# Altium schematic sheet LV_hairDrier.SchDoc
size OrCAD B; SheetNumber: 1; SheetTotal: 1
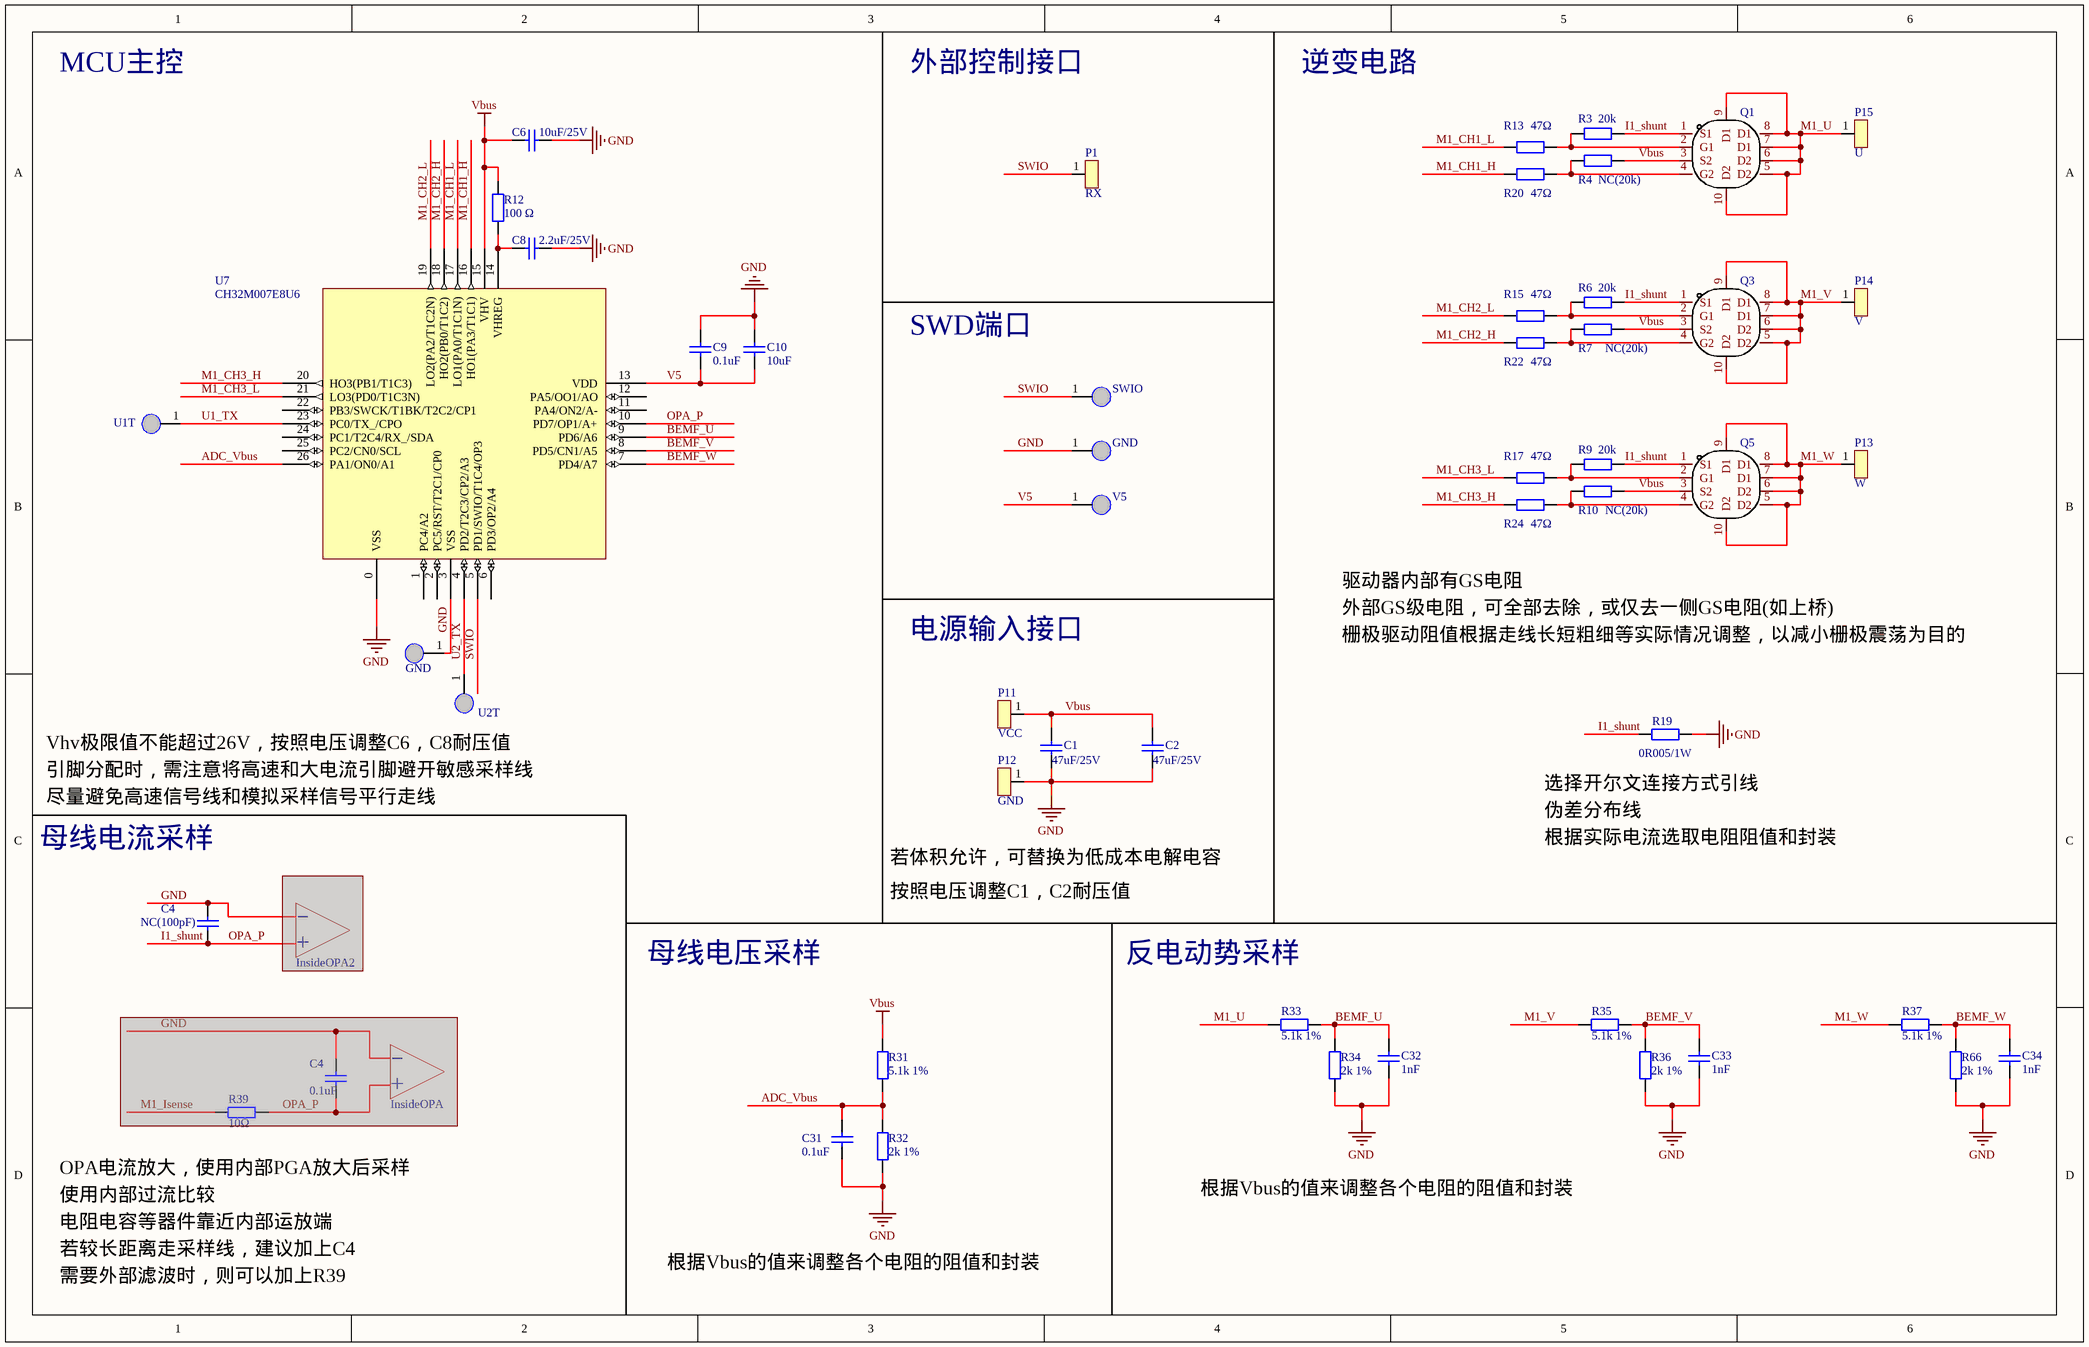
[diagram p0: LV_hairDrier.SchDoc]

## Parts
(Parts that share a designator on the sheet are numbered #1, #2 ... from top to bottom, then left to right.)
C1  47uF/25V  [M_C1206-]
C2  47uF/25V  [M_C1206-]
C4#1  NC(100pF)  [M_C0402-]
C4#2  0.1uF  [M_C0402-]  (masked out: inside a compile mask, not in the netlist)
C6  10uF/25V  [M_C0805-]
C8  2.2uF/25V  [M_C0603]
C9  0.1uF  [M_C0402-]
C10  10uF  [M_C0603]
C31  0.1uF  [M_C0402-]
C32  1nF  [M_C0402-]
C33  1nF  [M_C0402-]
C34  1nF  [M_C0402-]
P1  RX  [M_PAD-1.2/2]
P11  VCC  [M_PAD-1.2/2]
P12  GND  [M_PAD-1.2/2]
P13  W  [M_PAD-1.2/2]
P14  V  [M_PAD-1.2/2]
P15  U  [M_PAD-1.2/2]
Q1  (no value)  [M_DFN-8_L3.3_W3.2_2]
Q3  (no value)  [M_DFN-8_L3.3_W3.2_2]
Q5  (no value)  [M_DFN-8_L3.3_W3.2_2]
R3  20k  [M_R0402-]
R4  NC(20k)  [M_R0402-]
R6  20k  [M_R0402-]
R7  NC(20k)  [M_R0402-]
R9  20k  [M_R0402-]
R10  NC(20k)  [M_R0402-]
R12  100 Ω  [M_R0805-]
R13  47Ω  [M_R0402-]
R15  47Ω  [M_R0402-]
R17  47Ω  [M_R0402-]
R19  0R005/1W  [M_R1206-]
R20  47Ω  [M_R0402-]
R22  47Ω  [M_R0402-]
R24  47Ω  [M_R0402-]
R31  5.1k 1%  [M_R0402-]
R32  2k 1%  [M_R0402-]
R33  5.1k 1%  [M_R0402-]
R34  2k 1%  [M_R0402-]
R35  5.1k 1%  [M_R0402-]
R36  2k 1%  [M_R0402-]
R37  5.1k 1%  [M_R0402-]
R39  10Ω  [M_R0402-]  (masked out: inside a compile mask, not in the netlist)
R66  2k 1%  [M_R0402-]
TP1  U2T  [TEST-0.8]
TP2  U1T  [TEST-0.8]
TP3  SWIO  [TEST-0.8]
TP4  GND  [TEST-0.8]
TP5  V5  [TEST-0.8]
TP6  GND  [TEST-0.8]
U7  CH32M007E8U6  [QFN26C_3X3]
U?#1  InsideOPA2  (masked out: inside a compile mask, not in the netlist)
U?#2  InsideOPA  (masked out: inside a compile mask, not in the netlist)

## Nets
GND: C1.1 C2.1 C4#1.1 C6.2 C8.2 C9.2 C10.2 C31.2 C32.2 C33.2 C34.2 P12.1 R19.1 R32.1 R34.2 R36.2 R66.2 TP4.1 TP6.1 U7.0(VSS) U7.3(VSS)
Vbus: C1.2 C2.2 C6.1 P11.1 Q1.3(S2) Q3.3(S2) Q5.3(S2) R4.1 R7.2 R10.2 R12.2 R31.2 U7.15(VHV)
ADC_Vbus: C31.1 R31.1 R32.2 U7.26(PA1/ON0/A1)
BEMF_U: C32.1 R33.1 R34.1 U7.9(PD6/A6)
BEMF_V: C33.1 R35.1 R36.1 U7.8(PD5/CN1/A5)
BEMF_W: C34.1 R37.1 R66.1 U7.7(PD4/A7)
I1_shunt: C4#1.2 Q1.1(S1) Q3.1(S1) Q5.1(S1) R3.2 R6.2 R9.2 R19.2 U7.10(PD7/OP1/A+)  [also labelled OPA_P]
M1_CH1_H: R20.1 U7.16(HO1(PA3/T1C1))
M1_CH1_L: R13.1 U7.17(LO1(PA0/T1C1N))
M1_CH2_H: R22.1 U7.18(HO2(PB0/T1C2))
M1_CH2_L: R15.1 U7.19(LO2(PA2/T1C2N))
M1_CH3_H: R24.1 U7.20(HO3(PB1/T1C3))
M1_CH3_L: R17.1 U7.21(LO3(PD0/T1C3N))
M1_U: P15.1 Q1.5(D2) Q1.6(D2) Q1.7(D1) Q1.8(D1) Q1.9(D1) Q1.10(D2) R33.2
M1_V: P14.1 Q3.5(D2) Q3.6(D2) Q3.7(D1) Q3.8(D1) Q3.9(D1) Q3.10(D2) R35.2
M1_W: P13.1 Q5.5(D2) Q5.6(D2) Q5.7(D1) Q5.8(D1) Q5.9(D1) Q5.10(D2) R37.2
SWIO: P1.1 TP3.1 U7.5(PD1/SWIO/T1C4/OP3)
U1_TX: TP2.1 U7.23(PC0/TX_/CPO)
U2_TX: TP1.1 U7.4(PD2/T2C3/CP2/A3)
V5: C9.1 C10.1 TP5.1 U7.13(VDD)
NetC8_1: C8.1 R12.1 U7.14(VHREG)
NetQ1_2: Q1.2(G1) R3.1 R13.2
NetQ1_4: Q1.4(G2) R4.2 R20.2
NetQ3_2: Q3.2(G1) R6.1 R15.2
NetQ3_4: Q3.4(G2) R7.1 R22.2
NetQ5_2: Q5.2(G1) R9.1 R17.2
NetQ5_4: Q5.4(G2) R10.1 R24.2

Not connected (* = marked no-connect by the designer): U7 1(PC4/A2) 2(PC5/RST/T2C1/CP0) 6(PD3/OP2/A4) 11(PA4/ON2/A-) 12(PA5/OO1/AO) 22(PB3/SWCK/T1BK/T2C2/CP1) 24(PC1/T2C4/RX_/SDA) 25(PC2/CN0/SCL)

## Notes on the sheet
- MCU主控
- 外部控制接口
- 逆变电路
- SWD端口
- 驱动器内部有GS电阻
- 外部GS级电阻，可全部去除，或仅去一侧GS电阻(如上桥)
- 电源输入接口
- 栅极驱动阻值根据走线长短粗细等实际情况调整，以减小栅极震荡为目的
- Vhv极限值不能超过26V，按照电压调整C6，C8耐压值
- 引脚分配时，需注意将高速和大电流引脚避开敏感采样线
- 尽量避免高速信号线和模拟采样信号平行走线
- (near R19) 选择开尔文连接方式引线
- 伪差分布线
- 母线电流采样
- 若体积允许，可替换为低成本电解电容
- 根据实际电流选取电阻阻值和封装
- 母线电压采样
- 按照电压调整C1，C2耐压值
- 反电动势采样
- (near R39) OPA电流放大，使用内部PGA放大后采样
- 使用内部过流比较
- 电阻电容等器件靠近内部运放端
- 根据Vbus的值来调整各个电阻的阻值和封装
- 若较长距离走采样线，建议加上C4
- 需要外部滤波时，则可以加上R39
- (in symbol InsideOPA) +

## Library data of the parts
C1 C2 C4#1 C4#2 C6 C8-C10 C31-C34 = Cap Semi: Capacitor (Semiconductor SIM Model); Published: 8-Jun-2000; LatestRevisionDate: 17-Jul-2002; LatestRevisionNote: Re-released for DXP Platform.; PackageReference: C0805; Publisher: Altium Limited
  C1 C2: Value: 47uF/25V
  C4#1: Value: NC(100pF)
  C4#2 C9 C31: Value: 0.1uF
  C6: Value: 10uF/25V
  C8: Value: 2.2uF/25V
  C10: Value: 10uF
  C32-C34: Value: 1nF
P1 P11-P15 = 1PIN: CONNECTOR
Q1 Q3 Q5 = WSD3043DN
R3 R4 R6 R7 R9 R10 R12 R13 R15 R17 R19 R20 R22 R24 R31-R37 R39 R66 = Res2: Resistor; Published: 8-Jun-2000; LatestRevisionDate: 17-Jul-2002; LatestRevisionNote: Re-released for DXP Platform.; PackageReference: AXIAL-0.4; Publisher: Altium Limited
  R3 R6 R9: Value: 20k
  R4 R7 R10: Value: NC(20k)
  R12: Value: 100 Ω
  R13 R15 R17 R20 R22 R24: Value: 47Ω
  R19: Value: 0R005/1W
  R31 R33 R35 R37: Value: 5.1k 1%
  R32 R34 R36 R66: Value: 2k 1%
  R39: Value: 10Ω
TP1-TP6 = Testpoint: 测试点
U7 = CH32M007E8U6: RISC-V MCU, 48MHz, OPA/CMP/UART/I2C, 24V P/NMOS gate driver for motor
U?#1 = InsideOPA